# Altium schematic sheet Tiny817_Xplained_Pro_TopLevel.SchDoc: Top Level Schematics
size A3; Organization: ATMEL Norway; Address1: Vestre Rosten 79; Address2: N-7075 TILLER; Address3: NORWAY; DocumentNumber: A09-2654; Revision: 8; SheetNumber: 1; SheetTotal: 9; PageSetup: Record=PageOptions|CenterHorizontal=True|CenterVertical=True|PrintScale=1.01|XCorrection=1.00|YCorrection=1.00|PrintKind=1|BorderSize=5000000|LeftOffset=0|BottomOffset=0|Orientation=2|PaperLength=1000|PaperWidth=1000|Scale=100|PaperSource=7|PrintQuality=-4|MediaType=1|DitherType=10|PaperKind=Letter|PrintScaleMode=1; ProjectTitle: Tiny817 Xplained Pro; PCBNumber: A08-2506; PCBRevision: 4
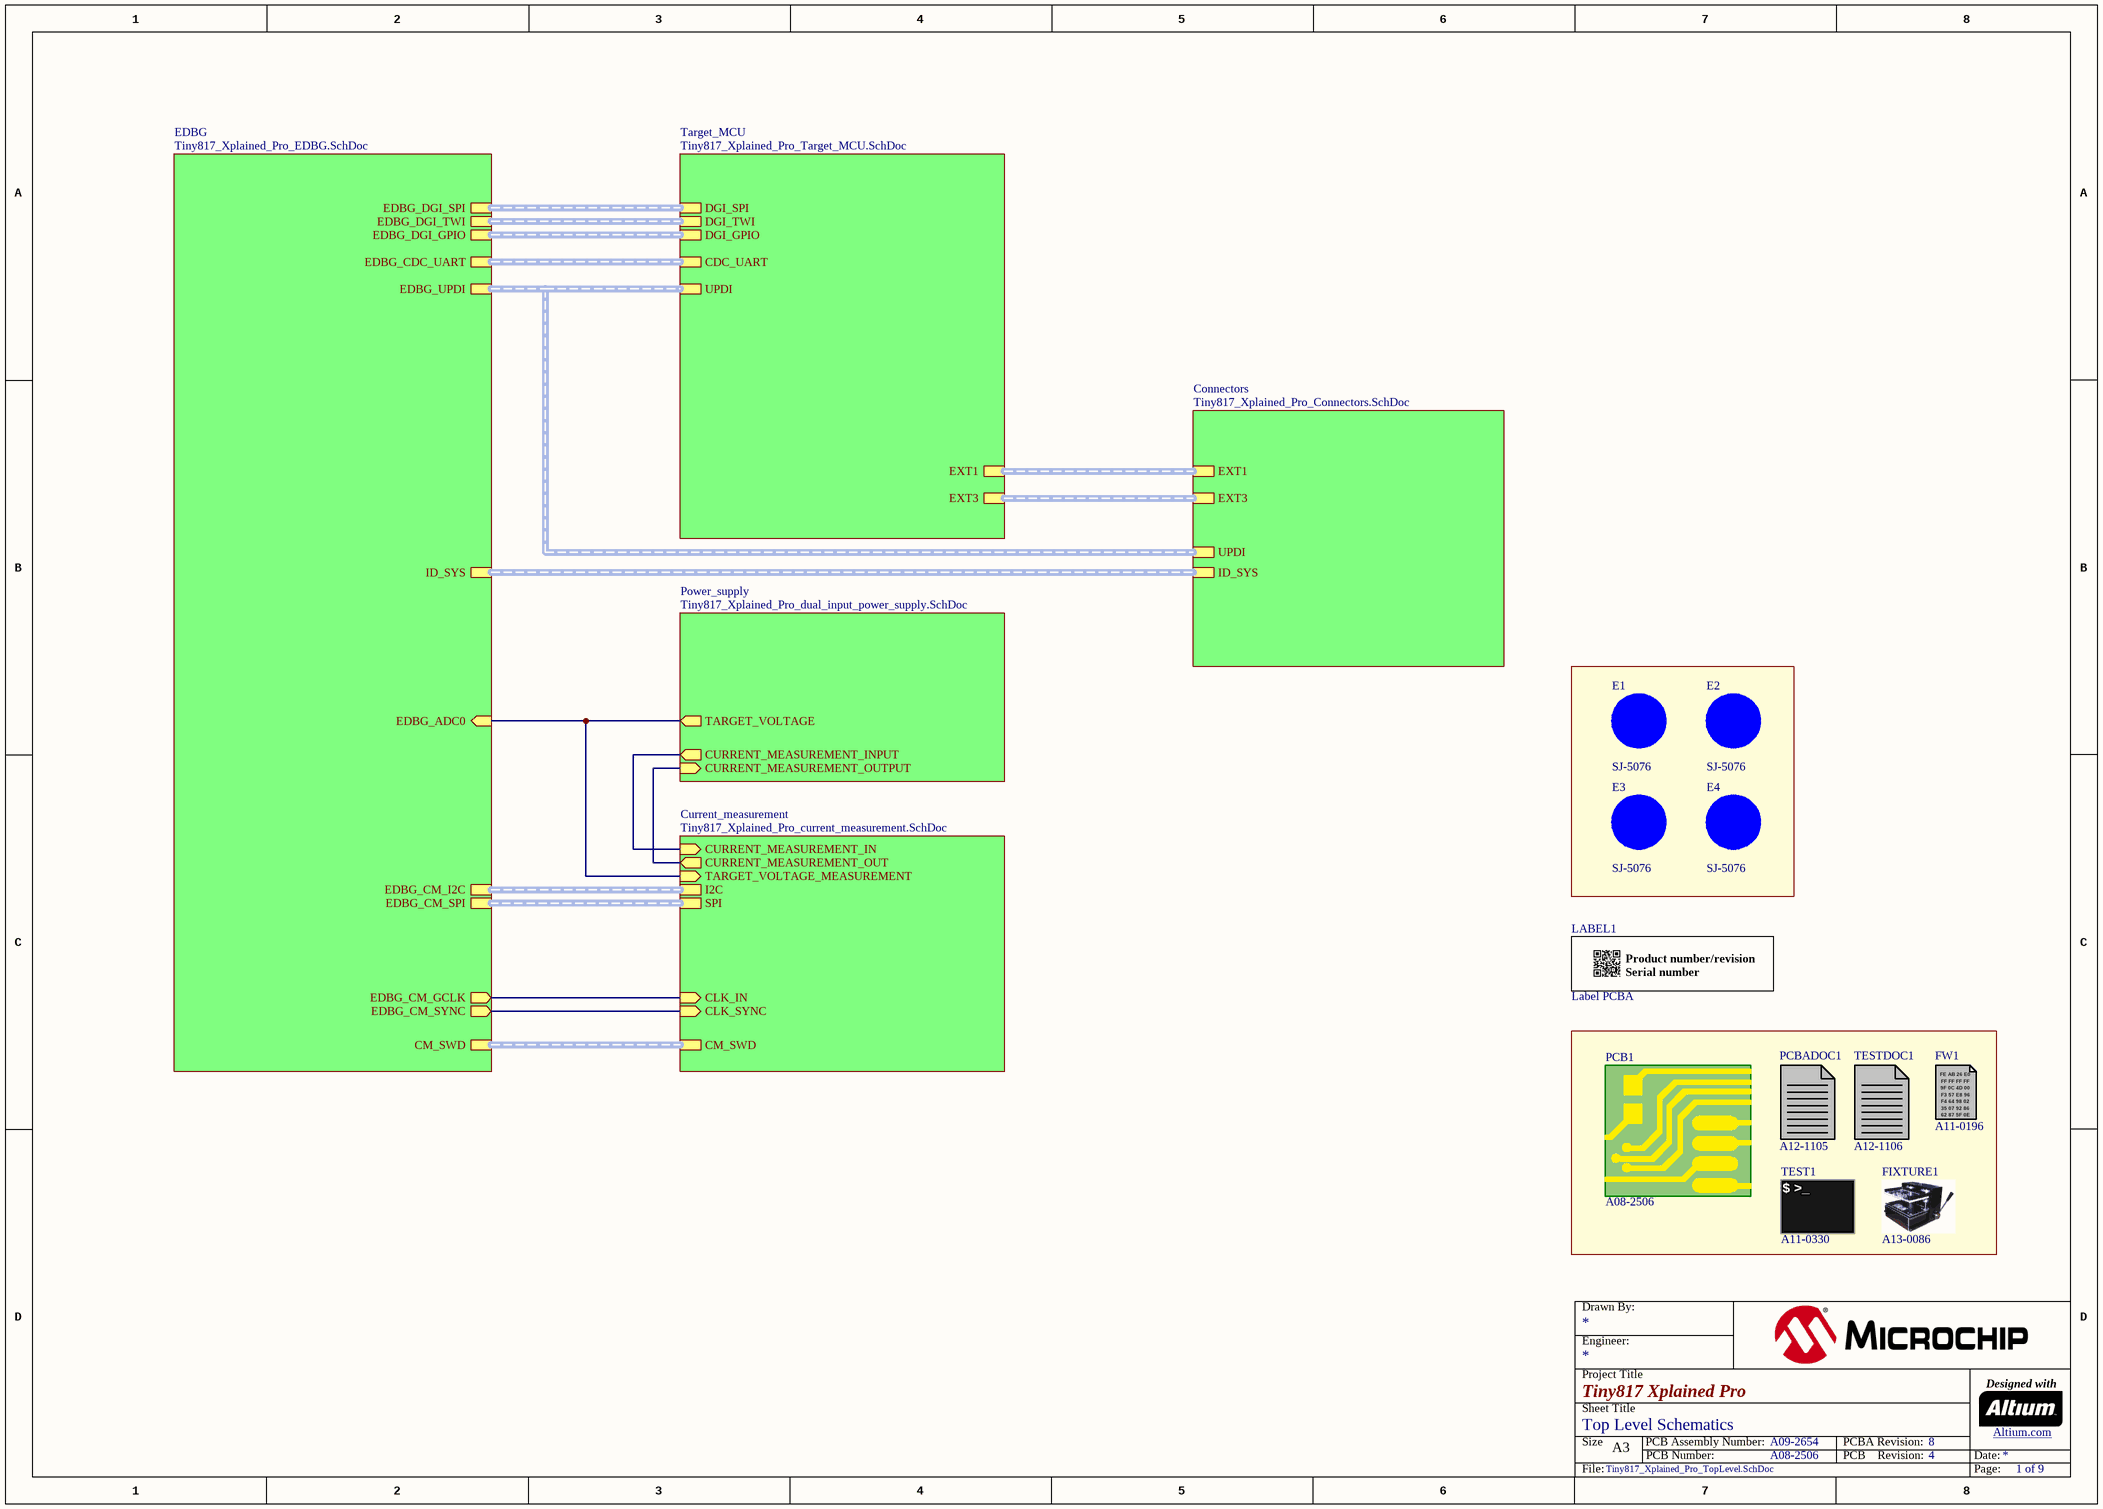
[diagram p0: Tiny817_Xplained_Pro_TopLevel.SchDoc]

## Parts
E1  value SJ-5076  [AP8-00192]
E2  value SJ-5076  [AP8-00192]
E3  value SJ-5076  [AP8-00192]
E4  value SJ-5076  [AP8-00192]
FIXTURE1  AN: A13-0086  (mechanical)
FW1  AN: A11-0196  (mechanical)
LABEL1  value Label PCBA  [AP8-00317]
PCB1  AN: A08-2506  (mechanical)
PCBADOC1  AN: A12-1105  (mechanical)
TEST1  AN: A11-0330  (mechanical)
TESTDOC1  AN: A12-1106  (mechanical)

## Sub-sheets
Connectors = Tiny817_Xplained_Pro_Connectors.SchDoc: EXT1 (harness EXT), EXT3 (harness EXT), UPDI (harness UPDI), ID_SYS (harness ID_SYS)
Current_measurement = Tiny817_Xplained_Pro_current_measurement.SchDoc: I2C (harness I2C), SPI (harness SPI), CLK_IN (in), CLK_SYNC (in), CURRENT_MEASUREMENT_OUT (out), CURRENT_MEASUREMENT_IN (in), TARGET_VOLTAGE_MEASUREMENT (in), CM_SWD (harness SWD)
EDBG = Tiny817_Xplained_Pro_EDBG.SchDoc: ID_SYS (harness ID_SYS), EDBG_CDC_UART (harness UART), EDBG_DGI_TWI (harness I2C), EDBG_DGI_SPI (harness SPI), EDBG_ADC0 (in), EDBG_CM_I2C (harness I2C), EDBG_CM_SPI (harness SPI), EDBG_CM_GCLK (out), EDBG_CM_SYNC (out), CM_SWD (harness SWD), EDBG_DGI_GPIO (harness GPIO), EDBG_UPDI (harness UPDI)
Power_supply = Tiny817_Xplained_Pro_dual_input_power_supply.SchDoc: TARGET_VOLTAGE (out), CURRENT_MEASUREMENT_INPUT (out), CURRENT_MEASUREMENT_OUTPUT (in)
Target_MCU = Tiny817_Xplained_Pro_Target_MCU.SchDoc: DGI_SPI (harness SPI), DGI_TWI (harness I2C), CDC_UART (harness UART), EXT3 (harness EXT), EXT1 (harness EXT), DGI_GPIO (harness GPIO), UPDI (harness UPDI)

## Nets
(unnamed): sheet EDBG/EDBG_ADC0, sheet Power_supply/TARGET_VOLTAGE, sheet Current_measurement/TARGET_VOLTAGE_MEASUREMENT
(unnamed): sheet EDBG/EDBG_CM_GCLK, sheet Current_measurement/CLK_IN
(unnamed): sheet EDBG/EDBG_CM_SYNC, sheet Current_measurement/CLK_SYNC
(unnamed): sheet Power_supply/CURRENT_MEASUREMENT_INPUT, sheet Current_measurement/CURRENT_MEASUREMENT_IN
(unnamed): sheet Power_supply/CURRENT_MEASUREMENT_OUTPUT, sheet Current_measurement/CURRENT_MEASUREMENT_OUT

Not connected (* = marked no-connect by the designer): E1 1(FIDUCIAL); E2 1(FIDUCIAL); E3 1(FIDUCIAL); E4 1(FIDUCIAL)

## Buses and harness runs
harness sheet Connectors/EXT1 = sheet Target_MCU/EXT1
harness sheet Connectors/EXT3 = sheet Target_MCU/EXT3
harness sheet Connectors/ID_SYS = sheet EDBG/ID_SYS
harness sheet Connectors/UPDI = sheet EDBG/EDBG_UPDI = sheet Target_MCU/UPDI
harness sheet Current_measurement/CM_SWD = sheet EDBG/CM_SWD
harness sheet Current_measurement/I2C = sheet EDBG/EDBG_CM_I2C
harness sheet Current_measurement/SPI = sheet EDBG/EDBG_CM_SPI
harness sheet EDBG/EDBG_CDC_UART = sheet Target_MCU/CDC_UART
harness sheet EDBG/EDBG_DGI_GPIO = sheet Target_MCU/DGI_GPIO
harness sheet EDBG/EDBG_DGI_SPI = sheet Target_MCU/DGI_SPI
harness sheet EDBG/EDBG_DGI_TWI = sheet Target_MCU/DGI_TWI

## Notes on the sheet
- Drawn By:
- Project Title
- Engineer:
- Designed with
- Sheet Title
- Size
- A3
- PCB Number:
- PCB Assembly Number:
- PCBA Revision:
- PCB    Revision:
- Date:
- Altium.com <http://go.altium.com/MicrochipLandingPage_Evaluation.html>
- File:
- Page:
- (in symbol A09-0611) / Product number/revision / Serial number
- (in symbol A11-0196) FE AB 26 E0; FF FF FF FF; 9F 0C 4D 00; F3 57 E8 96; F4 64 98 02; 35 07 92 86; 62 87 5F 0E
- (in symbol A11-0330) $ >_

## Library data of the parts
E1-E4 = A08-0053: 2.8mm adhesive feet,diam 8.0mm; PartGroup: Mechanical devices,Mounting accessories; Manufacturer: 3M; AN: A08-0053; Height: 2.79999995231628; MPN: SJ-5076
FIXTURE1 = A13-0086: Xplained PRO MCU board Jupiter Test Fixture; PartGroup: Test Equipment,Test Fixtures; Manufacturer: ESCATEC; Value: Xplained PRO MCU board Jupiter Test Fixture; MPN: Xplained PRO MCU board Jupiter Test Fixture
FW1 = A11-0196: EDBG secured firmware; PartGroup: Software,Firmware,Tools; Manufacturer: Microchip; Value: EDBG secured firmware
LABEL1 = A09-0611: PCBA identification label PP Top White Gloss; PartGroup: Mechanical devices,Packaging materials,Printed Labels,PCBA; Manufacturer: ACT Logimark AS; MPN: 505462; AN: A09-0611
PCB1 = A08-2506: ATtiny817 Xplained Pro PCB documentation; PartGroup: Mechanical devices,Printed circuit boards; Value: ATtiny817 Xplained Pro PCB documentation
PCBADOC1 = A12-1105: ATtiny817 Xplained Pro PCBA documentation; PartGroup: Documentation,PCBA Documents,Atmel; Value: A09-2654 PCBA Files
TEST1 = A11-0330: Fixture test for ATtiny817 Xplained Pro; PartGroup: Software,Test software,Starter Kit; Value: ATtiny817 Xplained Pro test
TESTDOC1 = A12-1106: ATtiny817 Xplained Pro Test Instructions; PartGroup: Documentation,Procedures,Test Instructions; Value: ATtiny817 Xplained Pro Test Instructions